# Altium schematic sheet EJECTION_CIRCUIT.SchDoc
size B; SheetNumber: 3; SheetTotal: 6
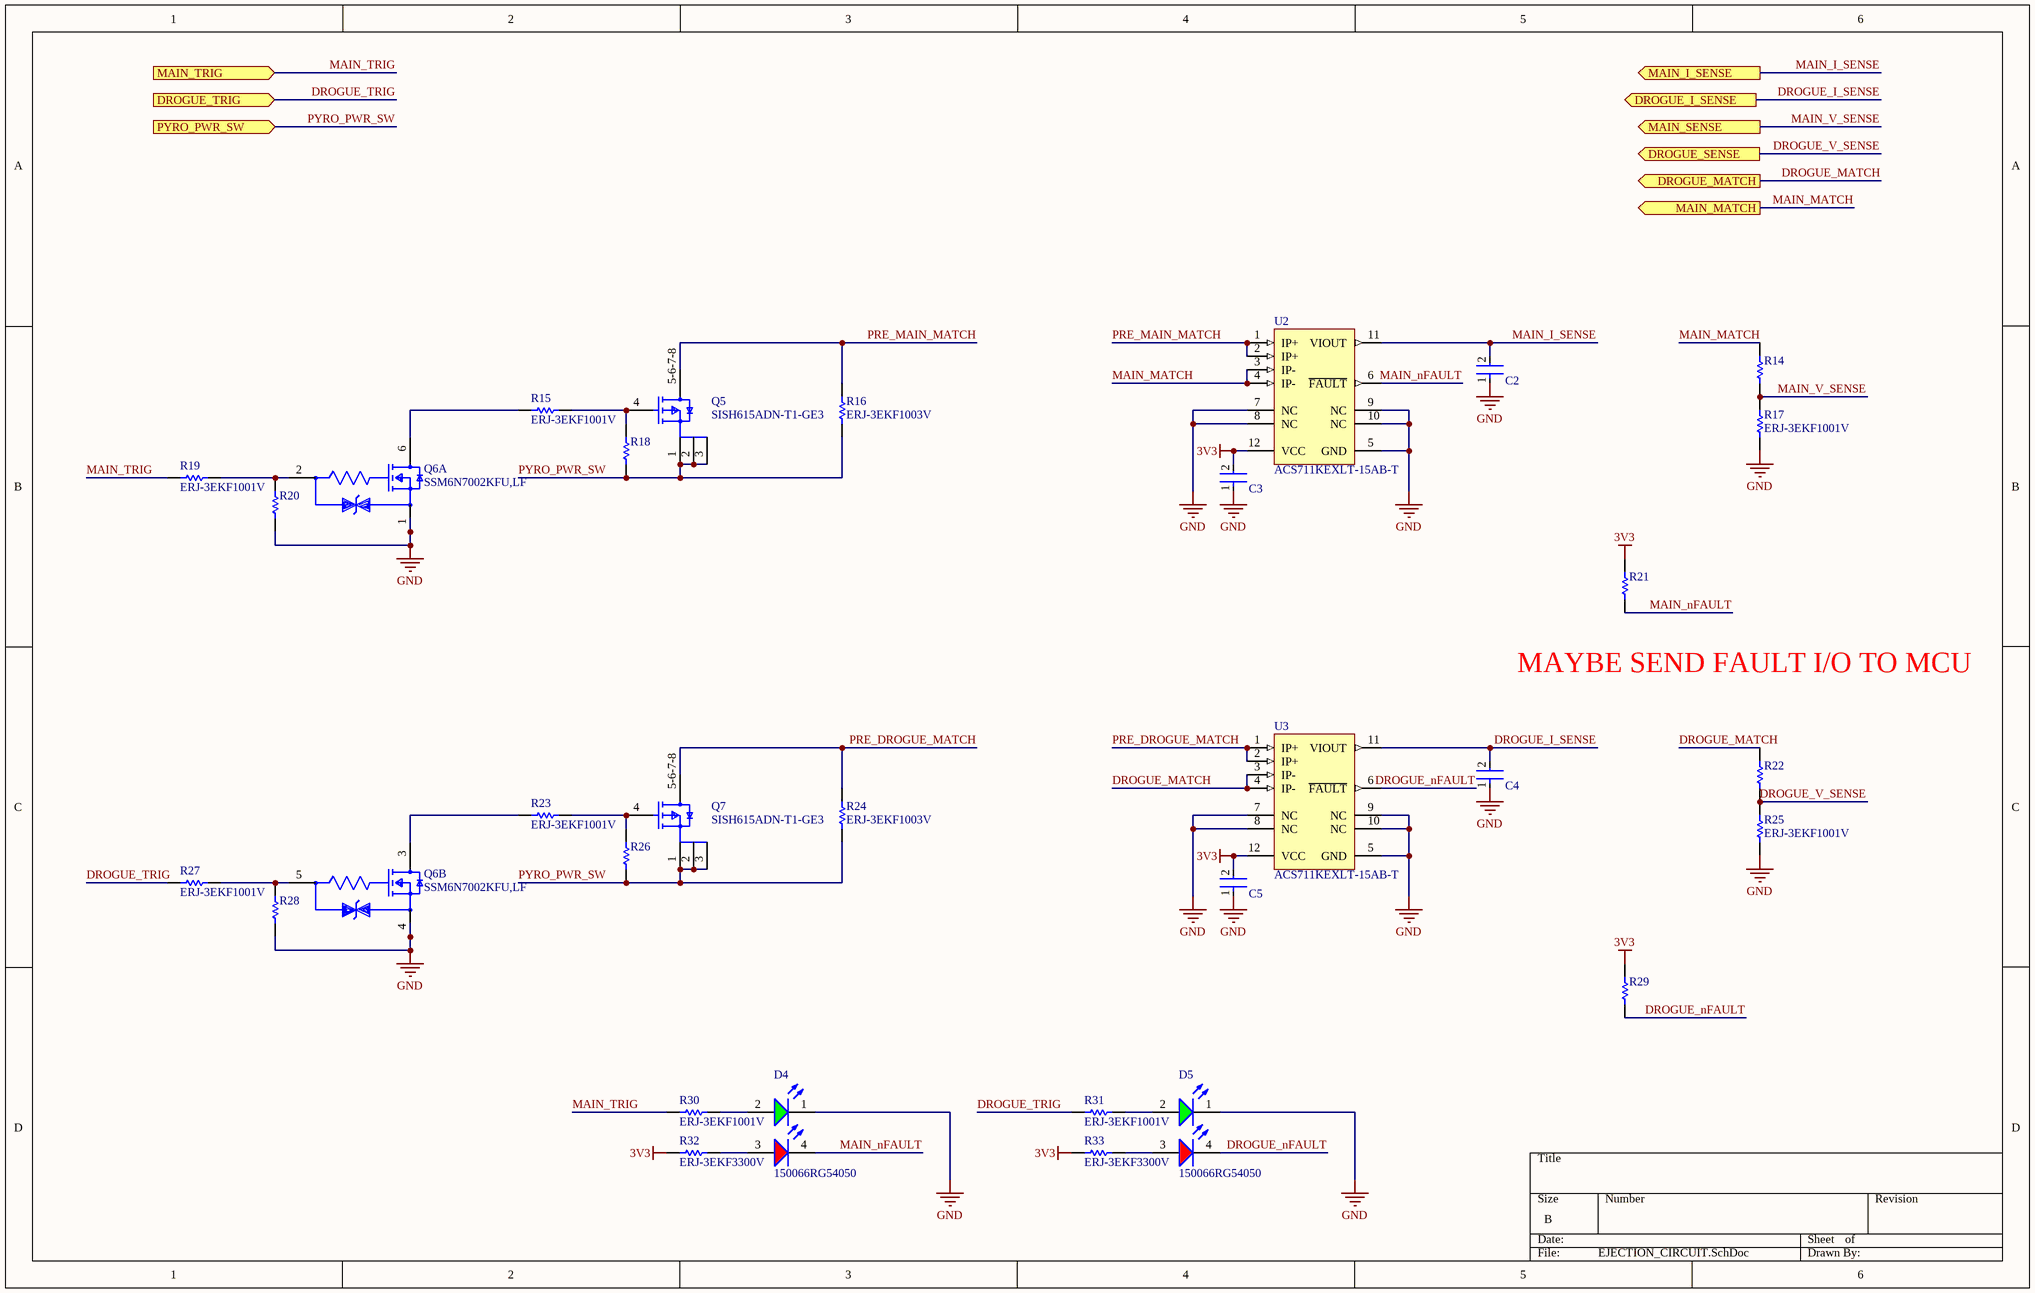
[diagram p0: EJECTION_CIRCUIT.SchDoc]

## Parts
C2  C0402C104K8PACTU  [FP-C0402-BB-MFG]  (value not drawn)
C3  C0402C104K8PACTU  [FP-C0402-BB-MFG]  (value not drawn)
C4  C0402C104K8PACTU  [FP-C0402-BB-MFG]  (value not drawn)
C5  C0402C104K8PACTU  [FP-C0402-BB-MFG]  (value not drawn)
D4  150066RG54050  [WL-SBCD_0606]
D5  150066RG54050  [WL-SBCD_0606]
Q5  SISH615ADN-T1-GE3  [SISH615ADN-T1-GE3-Footprint-1]
Q6  SSM6N7002KFU,LF  [FP-SSOP6-P-0_65A-MFG]  (parts A,B of 2)
Q7  SISH615ADN-T1-GE3  [SISH615ADN-T1-GE3-Footprint-1]
R14  ERJ3EKF1002V  [RESC1609X55X30LL15T15]  (value not drawn)
R15  ERJ-3EKF1001V  [RESC1608X55X30LL15T15]
R16  ERJ-3EKF1003V  [RESC1608X55X30ML15T15]
R17  ERJ-3EKF1001V  [RESC1608X55X30LL15T15]
R18  ERJ3EKF1002V  [RESC1609X55X30LL15T15]  (value not drawn)
R19  ERJ-3EKF1001V  [RESC1608X55X30LL15T15]
R20  ERJ3EKF1002V  [RESC1609X55X30LL15T15]  (value not drawn)
R21  ERJ3EKF1002V  [RESC1609X55X30LL15T15]  (value not drawn)
R22  ERJ3EKF1002V  [RESC1609X55X30LL15T15]  (value not drawn)
R23  ERJ-3EKF1001V  [RESC1608X55X30LL15T15]
R24  ERJ-3EKF1003V  [RESC1608X55X30ML15T15]
R25  ERJ-3EKF1001V  [RESC1608X55X30LL15T15]
R26  ERJ3EKF1002V  [RESC1609X55X30LL15T15]  (value not drawn)
R27  ERJ-3EKF1001V  [RESC1608X55X30LL15T15]
R28  ERJ3EKF1002V  [RESC1609X55X30LL15T15]  (value not drawn)
R29  ERJ3EKF1002V  [RESC1609X55X30LL15T15]  (value not drawn)
R30  ERJ-3EKF1001V  [RESC1608X55X30LL15T15]
R31  ERJ-3EKF1001V  [RESC1608X55X30LL15T15]
R32  ERJ-3EKF3300V  [RESC1608X55X30LL15T15]
R33  ERJ-3EKF3300V  [RESC1608X55X30LL15T15]
U2  ACS711KEXLT-15AB-T  [ALEG-EX-12_V]
U3  ACS711KEXLT-15AB-T  [ALEG-EX-12_V]

## Ports
DROGUE_I_SENSE (out, see HYDRA_V3_RECOVERY[4A], STM32G473CET6_PINOUT[5A]), DROGUE_MATCH (out, see HYDRA_V3_RECOVERY[4A]), DROGUE_SENSE (out, see HYDRA_V3_RECOVERY[4A], STM32G473CET6_PINOUT[5A]), DROGUE_TRIG (in, see HYDRA_V3_RECOVERY[4A], STM32G473CET6_PINOUT[5A]), MAIN_I_SENSE (out, see HYDRA_V3_RECOVERY[4A], STM32G473CET6_PINOUT[5A]), MAIN_MATCH (out, see HYDRA_V3_RECOVERY[4A]), MAIN_SENSE (out, see HYDRA_V3_RECOVERY[4A], STM32G473CET6_PINOUT[5A]), MAIN_TRIG (in, see HYDRA_V3_RECOVERY[4A], STM32G473CET6_PINOUT[5A]), PYRO_PWR_SW (in, see HYDRA_V3_RECOVERY[4A], SAFETY_SWITCH[2A])

## Nets
3V3: C3.2 C5.2 R21.2 R29.2 R32.1 R33.1 U2.12(VCC) U3.12(VCC)
GND: C2.1 C3.1 C4.1 C5.1 D4.1(K) D5.1(K) Q6.1(Source1) Q6.4(Source2) R17.1 R20.1 R25.1 R28.1 U2.5(GND) U2.7(NC) U2.8(NC) U2.9(NC) U2.10(NC) U3.5(GND) U3.7(NC) U3.8(NC) U3.9(NC) U3.10(NC)
DROGUE_I_SENSE: C4.2 U3.11(VIOUT) ; port DROGUE_I_SENSE
DROGUE_MATCH: R22.2 U3.3(IP-) U3.4(IP-) ; port DROGUE_MATCH
DROGUE_nFAULT: D5.4(K) R29.1 U3.6(~{FAULT})
DROGUE_TRIG: R27.1 R31.1 ; port DROGUE_TRIG
DROGUE_V_SENSE: R22.1 R25.2 ; port DROGUE_SENSE
MAIN_I_SENSE: C2.2 U2.11(VIOUT) ; port MAIN_I_SENSE
MAIN_MATCH: R14.2 U2.3(IP-) U2.4(IP-) ; port MAIN_MATCH
MAIN_nFAULT: D4.4(K) R21.1 U2.6(~{FAULT})
MAIN_TRIG: R19.1 R30.1 ; port MAIN_TRIG
MAIN_V_SENSE: R14.1 R17.2 ; port MAIN_SENSE
PRE_DROGUE_MATCH: Q7.5-6-7-8(D) R24.2 U3.1(IP+) U3.2(IP+)
PRE_MAIN_MATCH: Q5.5-6-7-8(D) R16.2 U2.1(IP+) U2.2(IP+)
PYRO_PWR_SW: Q5.1(S) Q5.2(S) Q5.3(S) Q7.1(S) Q7.2(S) Q7.3(S) R16.1 R18.1 R24.1 R26.1 ; port PYRO_PWR_SW
NetD4_2: D4.2(A) R30.2
NetD4_3: D4.3(A) R32.2
NetD5_2: D5.2(A) R31.2
NetD5_3: D5.3(A) R33.2
NetQ5_4: Q5.4(G) R15.2 R18.2
NetQ6_2: Q6.2(Gate1) R19.2 R20.2
NetQ6_3: Q6.3(Drain2) R23.1
NetQ6_5: Q6.5(Gate2) R27.2 R28.2
NetQ6_6: Q6.6(Drain1) R15.1
NetQ7_4: Q7.4(G) R23.2 R26.2

## Notes on the sheet
- (near R21) MAYBE SEND FAULT I/O TO MCU

## Library data of the parts
C2-C5 = CMP-2008-02046-2: CAP CER 0.1UF 10V X5R 0402; Manufacturer: Kemet; Material: Ceramic; Capacitance: 0.10 μF; Temperature Coefficient: 15%; Tolerance: 0.1; Value: 0.10 μF; Package: C0402-BB; Temperature: -55°C to +125°C; ComponentLink2Description: Datasheet; Temperature Characteristic: X5R; Device Class L1: Passive Components; Height: 0.55mm; Lead Free: Yes; ComponentLink2URL: https://content.kemet.com/datasheets/KEM_C1002_X7R_SMD.pdf; Device Class L2: Capacitors; Temperature Range Low: -55°C; Temperature Range High: +125°C; RoHS: TRUE; Octopart: https://octopart.com/c0402c104k8pactu-kemet-140039; Automotive: No; Mouser Description: Capacitor 100 nF 10 VDC 0402; Category: Cap; Voltage Rating: 10 V; Digikey Description: CAP CER 0.1UF 10V X5R 0402; Ipc Land Pattern Name: CAPC10050X50; Device Class L3: Ceramic Capacitors; Manufacturer Part Number: C0402C104K8PACTU
D4 D5 = CMP-004-00040-2: Led, Red/Grn, 180Mcd/230Mcd, 624Nm/525Nm Rohs Compliant: Yes; Source: rgled.SchLib; Component Type: Standard; Design Item ID: CMP-004-00034-2; Pins: 4
Q5 Q7 = CMP-013-00018-2: Trans MOSFET P-CH 20V 22.1A 8-Pin PowerPAK 1212 EP T/R; Source: SISH615ADN-T1-GE3.SchLib; Design Item ID: CMP-013-00036-4; Component Type: Standard; Pins: 5
Q6 = CMP-35916-000009-1: MOSFET 2N-CH 60V 0.3A; Input Capacitance: 40pF; Continuous Drain Current (ID): 300mA; Max Power Dissipation: 285mW; FET Type: 2 N-Channel; Rds On Max: 1.5R; Mount: Surface Mount; Drain to Source Voltage (Vdss): 60V; Packaging: Tape and Reel
R14 R18 R20-R22 R26 R28 R29 = CMP-1012-00623-3: Chip Resistor, 10 KOhm, +/- 1%, 0.1 W, -55 to 155 degC, 0603 (1608 Metric), RoHS, Tape and Reel; Manufacturer: Panasonic; Voltage Rating: 75V; Case\/Package: 0603; Power Rating: 100mW; Resistance: 10KOhm; Temperature Coefficient: 100ppm\/degreesC; Number of Pins: 2; Package Reference: 603; Depth: 0.8mm; Mount: SurfaceMount; Package Description: 2-Pin Surface Mount Device, Body 1.6 x 0.85 mm; Datasheet Version: 02/2017; Length: 1.6mm; Lead Free: LeadFree; Height: 0.45mm; Number of Terminations: 2; Max Power Dissipation: 100mW; Min Operating Temperature: -55degC; Datasheet URL: https://industrial.panasonic.com/cdbs/www-data/pdf/RDA0000/AOA0000C304.pdf; Termination: SMD/SMT; Case Code (Metric): 1608; Case Code (Imperial): 0603; Tolerance: 1%; Max Operating Temperature: 155degC; RoHSCompliant: true; Voltage Rating (DC): 75V; Radiation Hardening: No; Packaging: TapeandReel; Composition: ThickFilm; Mounting Technology: SurfaceMount; Manufacturer URL: http://www.panasonic.com/; Width: 0.031inch; REACH SVHC: NoSVHC; Contact Plating: Tin; Military Standard: Not; Package Quantity: 1
R15 R17 R19 R23 R25 R27 R30 R31 = CMP-2000-00180-1: Manufacturer: Panasonic; Part Number: ERJ-3EKF1001V
R16 R24 = CMP-2000-00182-1: Manufacturer: Panasonic; Part Number: ERJ-3EKF1003V
R32 R33 = CMP-2000-00435-2: Chip Resistor, 330 Ohm, +/- 1%, 0.1 W, -55 to 155 degC, 0603 (1608 Metric), RoHS, Tape and Reel; Gender: Male; Mating Cycles: 10000; Current Rating: 500 mA; Voltage Rating: 10 V; REACH SVHC: No SVHC; PackageDescription: 2-Pin Surface Mount Device, Body 1.6 x 0.85 mm; Contact Finish: Gold; Pins: 8; ComponentLink1Description: Manufacturer URL; Packaging: Tape and Reel; Max Operating Temperature: 85 degC; Contact Material: Copper; Height: 1.45 mm; Width: 1.45 mm; DatasheetVersion: Apr-15; Package Quantity: 1500; Contact Plating: Gold; PackageReference: 0603; Mount: Surface Mount; Lead Pitch: 1.1 mm; Min Operating Temperature: -25 degC; ComponentLink1URL: http://www.panasonic.com/; ComponentLink2URL: http://industrial.panasonic.com/cdbs/www-data/pdf/RDA0000/AOA0000C86.pdf; Length: 13.7 mm; ComponentLink2Description: Datasheet; RoHSCompliant: true
U2 U3 = CMP-1557-00001-1: Hall Effect Linear Current Sensor with Overcurrent Fault Output for <100 V Isolation Applications, 3 to 5.5 V, -15.5 to 15.5 A IP, -40 to 125 degC, 12-Pin QFN (EX), RoHS, Tape and Reel; VCC Max: 5.5 V; IP Max: 15.5 A; VCC Min: 3 V; IP Min: -15.5 A; -3dB Bandwidth: 0.1 MHz; PackageDescription: 12-Pin Quad Flat No-Lead, Body 3 x 3 mm, Height 0.8 mm; ComponentLink1URL: http://www.allegromicro.com/; Packing: Tape and Reel; ComponentLink2URL: http://www.allegromicro.com/~/media/Files/Datasheets/ACS711-Datasheet.ashx?la=en; DatasheetVersion: Rev. 3; PartNumber: ACS711KEXLT-15AB-T; ComponentLink2Description: Datasheet; ComponentLink3URL: http://www.allegromicro.com/~/media/Files/Datasheets/ACS711-Datasheet.ashx?la=en; RoHS: TRUE; ComponentLink1Description: Manufacturer URL; ComponentLink3Description: Package Specification; Temperature Max: 125 degC; Mounting Technology: Surface Mount; Temperature Min: -40 degC